# Altium schematic sheet Remote.SchDoc
size A2
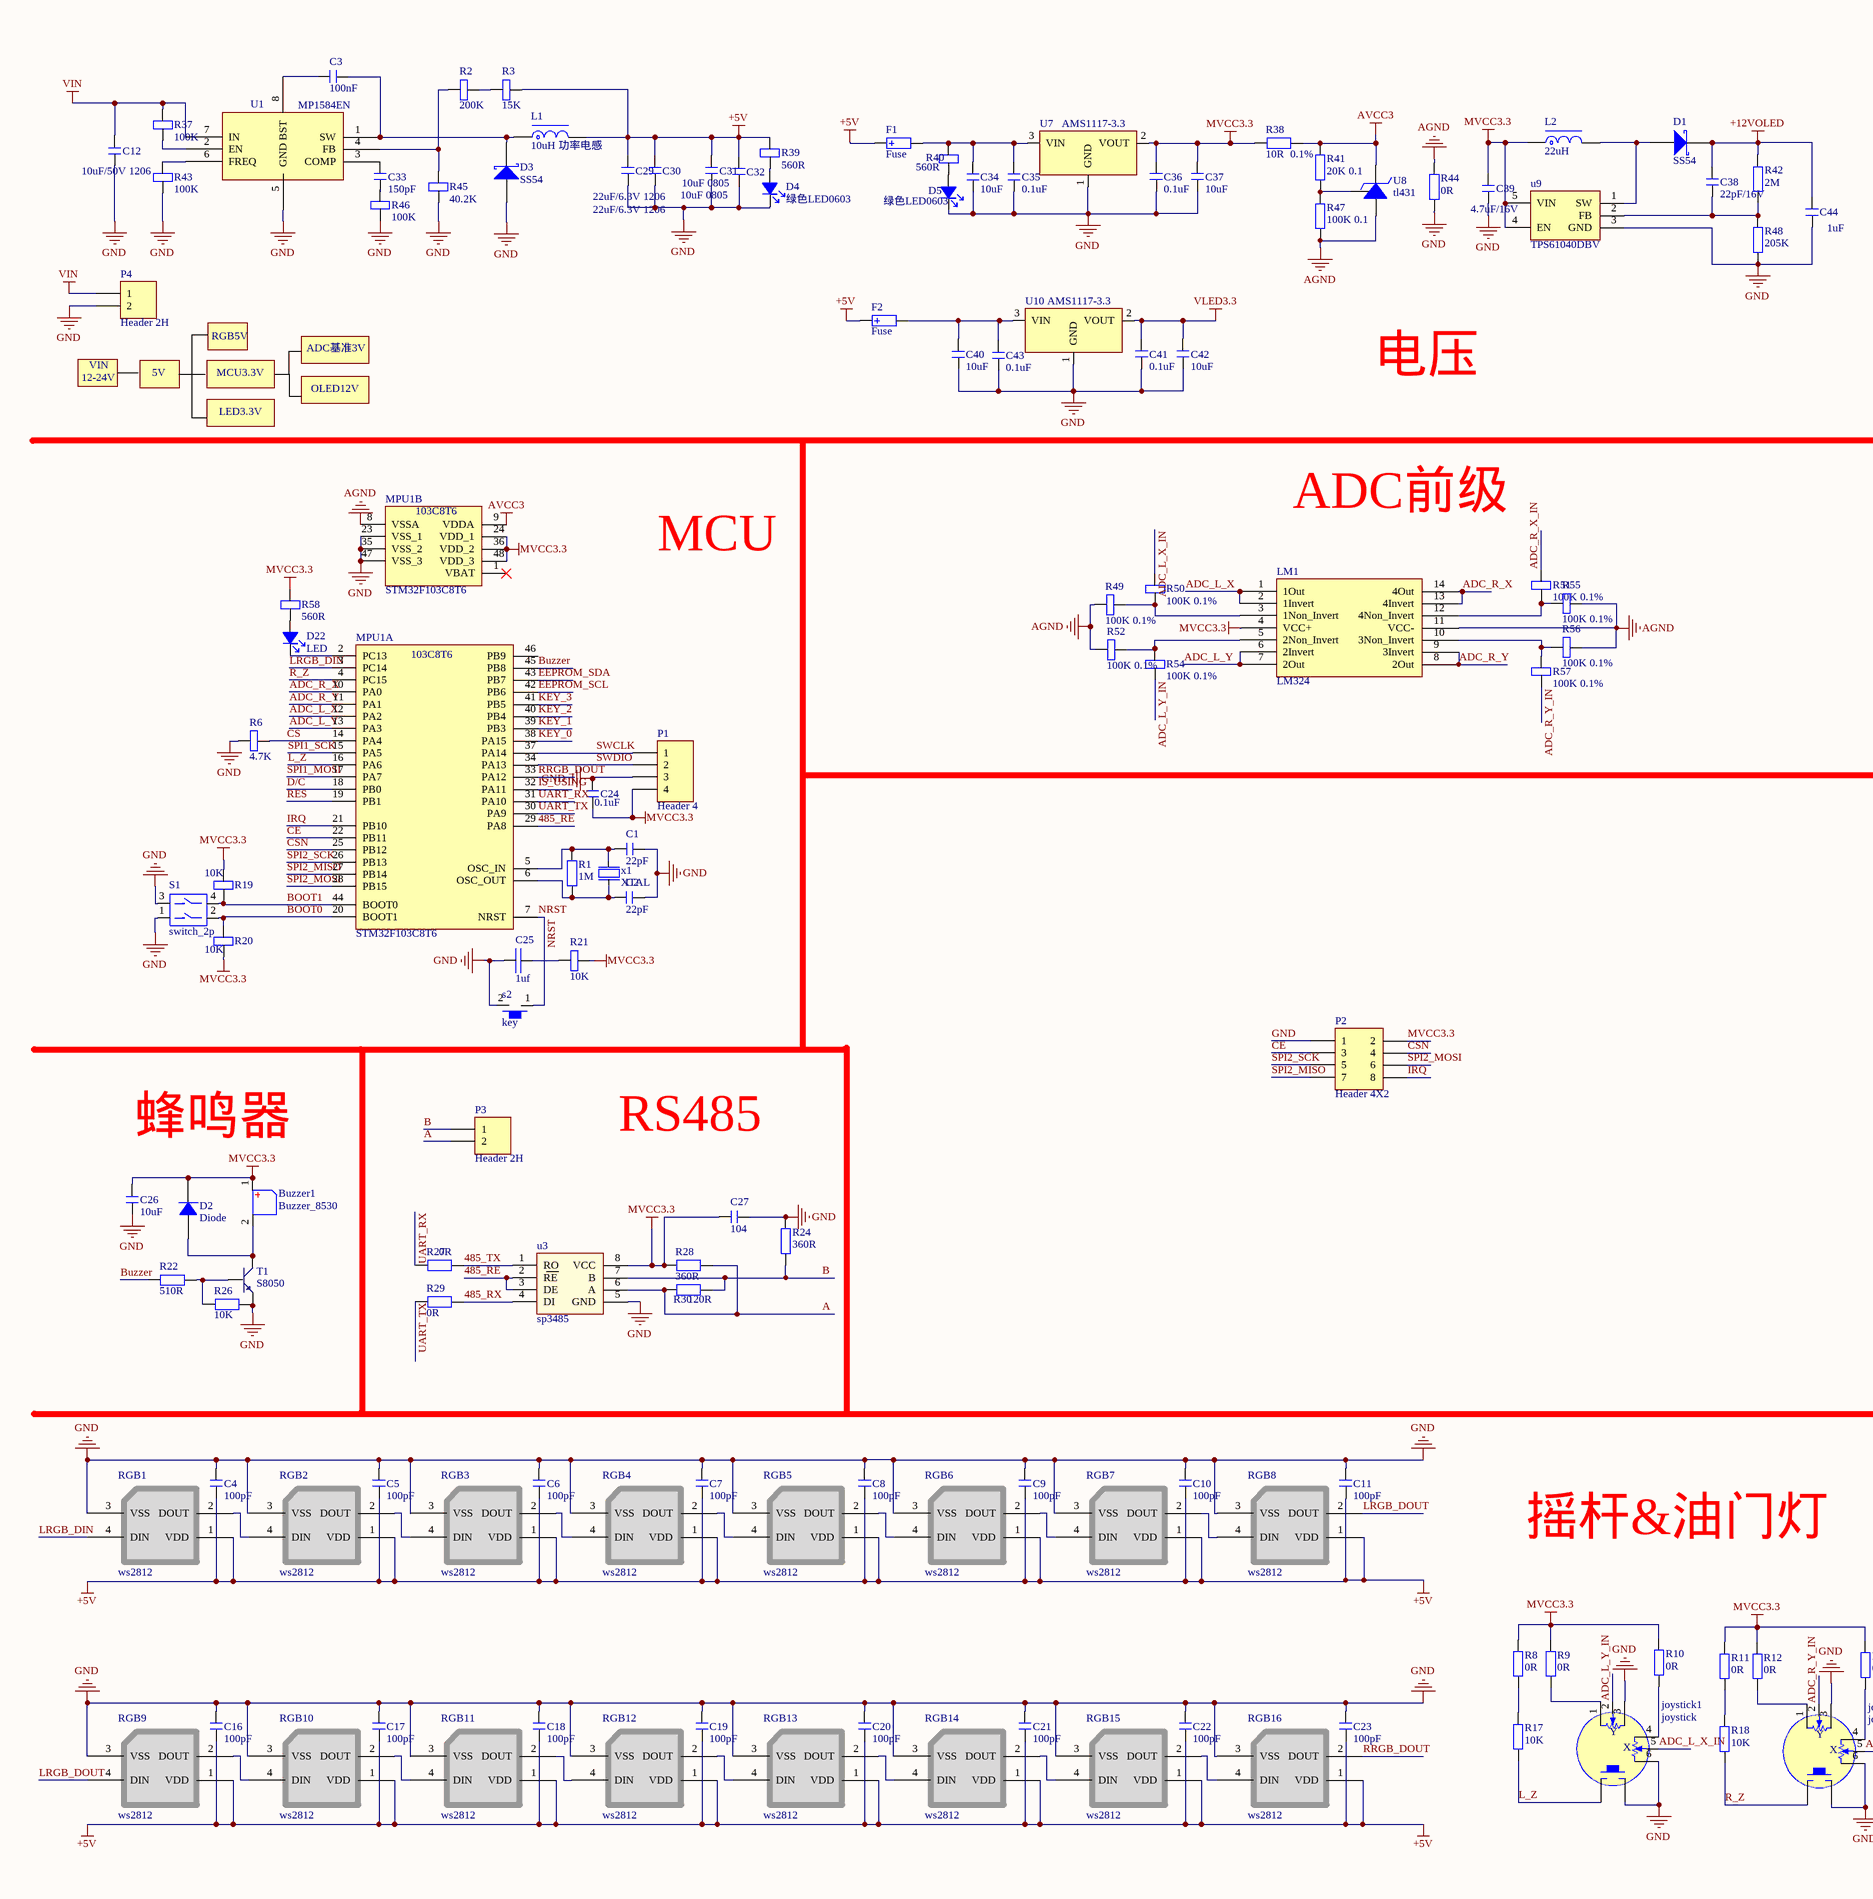
[diagram p0: Remote.SchDoc, left]
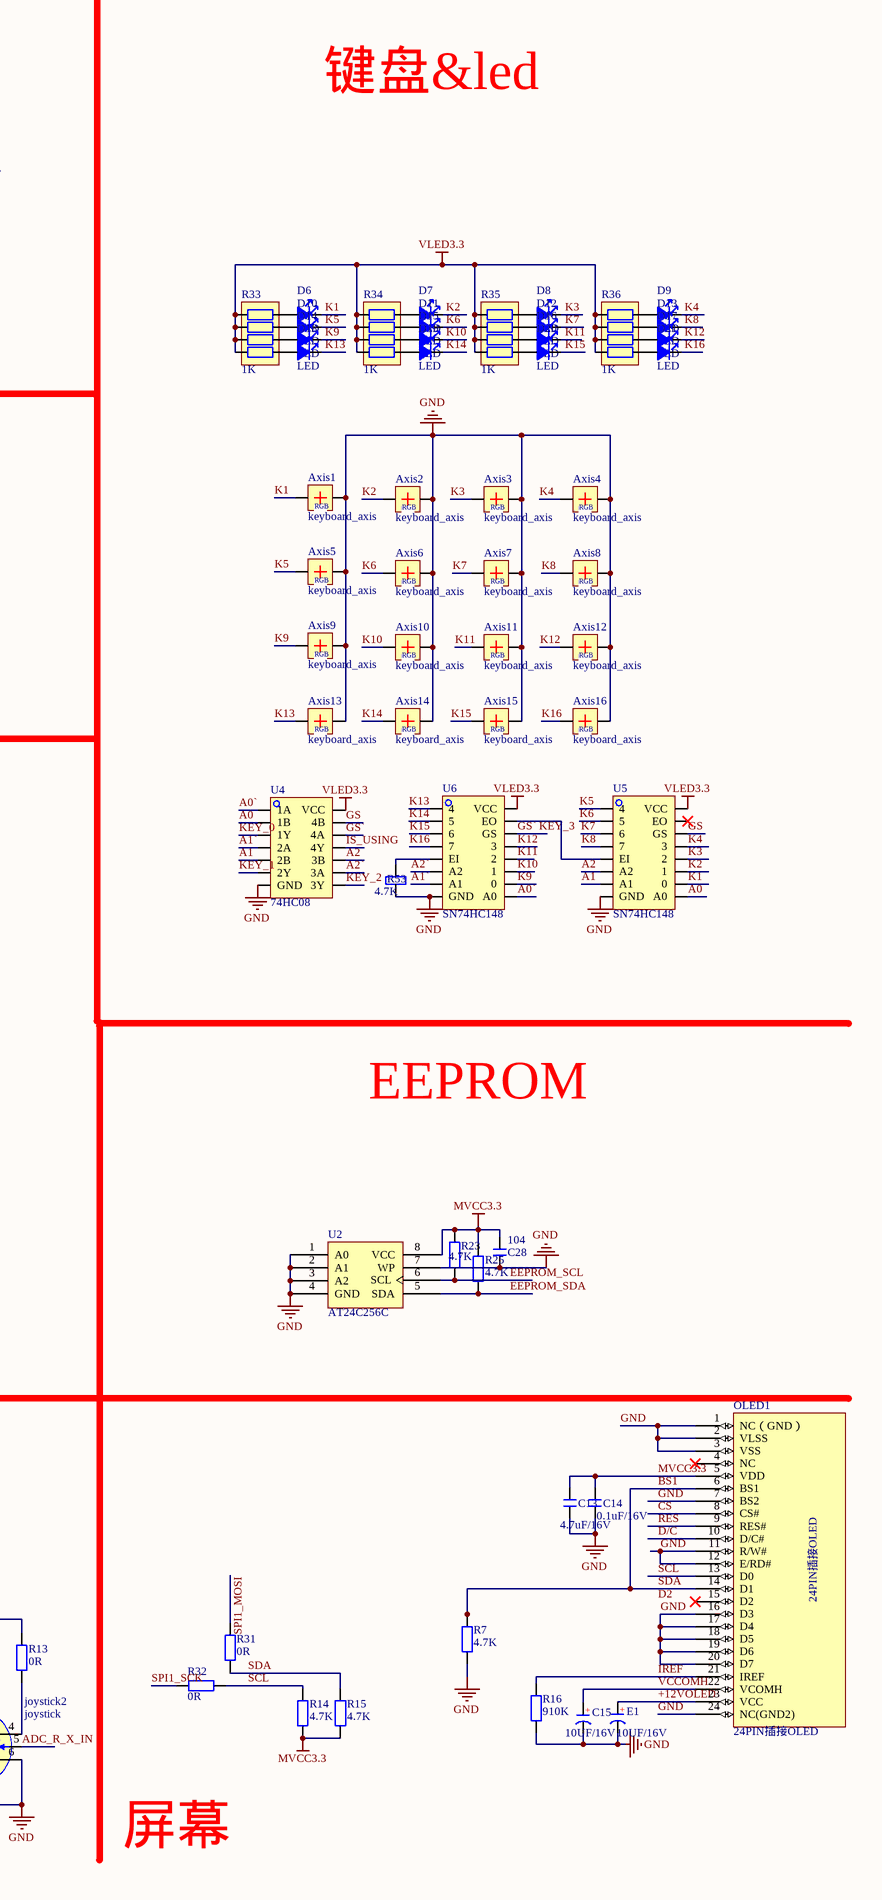
[diagram p1: Remote.SchDoc, right]

## Parts
Axis1  keyboard_axis  [KEY_AXIS]
Axis2  keyboard_axis  [KEY_AXIS]
Axis3  keyboard_axis  [KEY_AXIS]
Axis4  keyboard_axis  [KEY_AXIS]
Axis5  keyboard_axis  [KEY_AXIS]
Axis6  keyboard_axis  [KEY_AXIS]
Axis7  keyboard_axis  [KEY_AXIS]
Axis8  keyboard_axis  [KEY_AXIS]
Axis9  keyboard_axis  [KEY_AXIS]
Axis10  keyboard_axis  [KEY_AXIS]
Axis11  keyboard_axis  [KEY_AXIS]
Axis12  keyboard_axis  [KEY_AXIS]
Axis13  keyboard_axis  [KEY_AXIS]
Axis14  keyboard_axis  [KEY_AXIS]
Axis15  keyboard_axis  [KEY_AXIS]
Axis16  keyboard_axis  [KEY_AXIS]
Buzzer1  Buzzer_8530  [BUZZER_8530]
C1  22pF  [C 0603]
C2  22pF  [C 0603]
C3  100nF  [C 0603]
C4  100pF  [C 0603]
C5  100pF  [C 0603]
C6  100pF  [C 0603]
C7  100pF  [C 0603]
C8  100pF  [C 0603]
C9  100pF  [C 0603]
C10  100pF  [C 0603]
C11  100pF  [C 0603]
C12  10uF/50V 1206  [C 1206]
C13  4.7uF/16V  [C 0603]
C14  0.1uF/16V  [C 0402]
C15  10UF/16V  [C 1206 - polar]
C16  100pF  [C 0603]
C17  100pF  [C 0603]
C18  100pF  [C 0603]
C19  100pF  [C 0603]
C20  100pF  [C 0603]
C21  100pF  [C 0603]
C22  100pF  [C 0603]
C23  100pF  [C 0603]
C24  0.1uF  [C 0603]
C25  1uf  [0402]
C26  10uF  [C 0603]
C27  104  [C 0603]
C28  104  [C 0603]
C29  22uF/6.3V 1206  [C 1206]
C30  22uF/6.3V 1206  [C 1206]
C31  10uF 0805  [C 0805]
C32  10uF 0805  [C 0805]
C33  150pF  [C 0603]
C34  10uF  [C 0603]
C35  0.1uF  [C 0603]
C36  0.1uF  [C 0603]
C37  10uF  [C 0603]
C38  22pF/16V  [C 0603]
C39  4.7uF/16V  [C 0603]
C40  10uF  [C 0603]
C41  0.1uF  [C 0603]
C42  10uF  [C 0603]
C43  0.1uF  [C 0603]
C44  1uF  [C 0603]
D1  SS54  [DO-214AC/SMA]
D2  Diode  [SOD-123FL]
D3  SS54  [DO-214AC/SMA]
D4  绿色LED0603  [C 0603]
D5  绿色LED0603  [C 0603]
D6  LED  [C 0603]
D7  LED  [C 0603]
D8  LED  [C 0603]
D9  LED  [C 0603]
D10  LED  [C 0603]
D11  LED  [C 0603]
D12  LED  [C 0603]
D13  LED  [C 0603]
D14  LED  [C 0603]
D15  LED  [C 0603]
D16  LED  [C 0603]
D17  LED  [C 0603]
D18  LED  [C 0603]
D19  LED  [C 0603]
D20  LED  [C 0603]
D21  LED  [C 0603]
D22  LED  [C 0603]
E1  10UF/16V  [C 1206 - polar]
F1  Fuse  [F0805]
F2  Fuse  [F0805]
joystick1  joystick  [JoyStick]
joystick2  joystick  [JoyStick]
L1  10uH 功率电感  [10uH]
L2  22uH  [R 0805]
LM1  LM324  [LM324]
MPU1  STM32F103C8T6  [stm32f103c8t6]  (parts A,B of 2)
OLED1  24PIN插接OLED  [FPC0.5 2H-S-W-24P]
P1  Header 4  [HDR1X4]
P2  Header 4X2  [HDR2X4]
P3  Header 2H  [HDR1X2H]
P4  Header 2H  [XT30-PW-M]
R1  1M  [R 0603]
R2  200K  [R 0603]
R3  15K  [R 0603]
R6  4.7K  [R 0603]
R7  4.7K  [R 0603]
R8  0R  [R 0603]
R9  0R  [R 0603]
R10  0R  [R 0603]
R11  0R  [R 0603]
R12  0R  [R 0603]
R13  0R  [R 0603]
R14  4.7K  [R 0603]
R15  4.7K  [R 0603]
R16  910K  [R 0603]
R17  10K  [R 0603]
R18  10K  [R 0603]
R19  10K  [R 0603]
R20  10K  [R 0603]
R21  10K  [R 0603]
R22  510R  [R 0603]
R23  4.7K  [R 0603]
R24  360R  [R 0603]
R25  4.7K  [R 0603]
R26  10K  [R 0603]
R27  0R  [R 0402]
R28  360R  [R 0603]
R29  0R  [R 0402]
R30  120R  [R 0603]
R31  0R  [R 0603]
R32  0R  [R 0603]
R33  1K  [CHIP-ARRY]
R34  1K  [CHIP-ARRY]
R35  1K  [CHIP-ARRY]
R36  1K  [CHIP-ARRY]
R37  100K  [R 0603]
R38  10R  0.1%  [R 0603]
R39  560R  [R 0603]
R40  560R  [R 0603]
R41  20K 0.1  [R 0603]
R42  2M  [R 0603]
R43  100K  [R 0603]
R44  0R  [R 0603]
R45  40.2K  [R 0603]
R46  100K  [R 0603]
R47  100K 0.1  [R 0603]
R48  205K  [R 0603]
R49  100K 0.1%  [R 0603]
R50  100K 0.1%  [R 0603]
R51  100K 0.1%  [R 0603]
R52  100K 0.1%  [R 0603]
R53  4.7K  [R 0603]
R54  100K 0.1%  [R 0603]
R55  100K 0.1%  [R 0603]
R56  100K 0.1%  [R 0603]
R57  100K 0.1%  [R 0603]
R58  560R  [R 0603]
RGB1  ws2812  [WS2812-5050-4p]
RGB2  ws2812  [WS2812-5050-4p]
RGB3  ws2812  [WS2812-5050-4p]
RGB4  ws2812  [WS2812-5050-4p]
RGB5  ws2812  [WS2812-5050-4p]
RGB6  ws2812  [WS2812-5050-4p]
RGB7  ws2812  [WS2812-5050-4p]
RGB8  ws2812  [WS2812-5050-4p]
RGB9  ws2812  [WS2812-5050-4p]
RGB10  ws2812  [WS2812-5050-4p]
RGB11  ws2812  [WS2812-5050-4p]
RGB12  ws2812  [WS2812-5050-4p]
RGB13  ws2812  [WS2812-5050-4p]
RGB14  ws2812  [WS2812-5050-4p]
RGB15  ws2812  [WS2812-5050-4p]
RGB16  ws2812  [WS2812-5050-4p]
S1  switch_2p  [SWITCH_2P]
s2  key  [KEY]
T1  S8050  [SOT-23-3]
U1  MP1584EN  [SOIC-8-EP-150mil]
U2  AT24C256C  [SOIC-8]
u3  sp3485  [sp3485]
U4  74HC08  [SOIC-14-150MIL]
U5  SN74HC148  [SOIC-16-150mil]
U6  SN74HC148  [SOIC-16-150mil]
U7  AMS1117-3.3  [ASM1117]
U8  tl431  [SOT-23-3]
u9  TPS61040DBV  [SOT-23-5]
U10  AMS1117-3.3  [ASM1117]
x1  XTAL  [XTAL-5032-2p]

## Nets
+5V: C4.2 C5.2 C6.2 C7.2 C8.2 C9.2 C10.2 C11.2 C16.2 C17.2 C18.2 C19.2 C20.2 C21.2 C22.2 C23.2 C29.1 C30.1 C31.1 C32.1 F1.1 F2.1 L1.2 R3.2 R39.1 RGB1.1(VDD) RGB2.1(VDD) RGB3.1(VDD) RGB4.1(VDD) RGB5.1(VDD) RGB6.1(VDD) RGB7.1(VDD) RGB8.1(VDD) RGB9.1(VDD) RGB10.1(VDD) RGB11.1(VDD) RGB12.1(VDD) RGB13.1(VDD) RGB14.1(VDD) RGB15.1(VDD) RGB16.1(VDD)
+12VOLED: C38.2 C44.2 D1.2(K) E1.1(A) OLED1.23(VCC) R42.2
AGND: LM1.11(VCC-) MPU1.8(VSSA) R44.1 R47.1 R49.1 R52.1 R55.2 R56.2 U8.3
AVCC3: MPU1.9(VDDA) R38.1 R41.2 U8.2
GND: Axis1.2 Axis2.2 Axis3.2 Axis4.2 Axis5.2 Axis6.2 Axis7.2 Axis8.2 Axis9.2 Axis10.2 Axis11.2 Axis12.2 Axis13.2 Axis14.2 Axis15.2 Axis16.2 C1.2 C2.1 C4.1 C5.1 C6.1 C7.1 C8.1 C9.1 C10.1 C11.1 C12.1 C13.1 C14.1 C15.2(K) C16.1 C17.1 C18.1 C19.1 C20.1 C21.1 C22.1 C23.1 C24.2 C25.2 C26.1 C27.2 C28.2 C29.2 C30.2 C31.2 C32.2 C34.1 C35.1 C36.2 C37.2 C39.1 C40.1 C41.2 C42.2 C43.1 C44.1 D3.1(A) D4.2 D5.2 E1.2(K) joystick1.3 joystick1.6 joystick1.J1 joystick2.3 joystick2.6 joystick2.J1 MPU1.23(VSS_1) MPU1.35(VSS_2) MPU1.47(VSS_3) OLED1.1(NC（GND）) OLED1.2(VLSS) OLED1.3(VSS) OLED1.7(BS2) OLED1.11(R/W#) OLED1.12(E/RD#) OLED1.16(D3) OLED1.17(D4) OLED1.18(D5) OLED1.19(D6) OLED1.20(D7) OLED1.24(NC(GND2)) P1.3 P2.1 P4.2 R6.1 R7.1 R16.1 R24.2 R26.2 R43.1 R44.2 R45.1 R46.1 R48.1 R53.2 RGB1.3(VSS) RGB2.3(VSS) RGB3.3(VSS) RGB4.3(VSS) RGB5.3(VSS) RGB6.3(VSS) RGB7.3(VSS) RGB8.3(VSS) RGB9.3(VSS) RGB10.3(VSS) RGB11.3(VSS) RGB12.3(VSS) RGB13.3(VSS) RGB15.3(VSS) RGB16.3(VSS) S1.1 S1.3 s2.2 T1.2(E) U1.5(GND) U2.1(A0) U2.2(A1) U2.3(A2) U2.4(GND) U2.7(WP) u3.5(GND) U4.7(GND) U5.8(GND) U6.8(GND) U7.1(GND) u9.3(GND) U10.1(GND)
MVCC3.3: Buzzer1.1 C13.2 C14.2 C24.1 C26.2 C27.1 C28.1 C36.1 C37.1 C39.2 D2.2(K) L2.1 LM1.4(VCC+) MPU1.24(VDD_1) MPU1.36(VDD_2) MPU1.48(VDD_3) OLED1.5(VDD) P1.4 P2.2 R8.2 R9.1 R10.1 R11.2 R12.1 R13.1 R14.1 R15.1 R19.1 R20.2 R21.2 R23.2 R25.2 R28.1 R38.2 R58.2 U2.8(VCC) u3.8(VCC) U7.2(VOUT) u9.4(EN) u9.5(VIN)
VIN: C12.2 P4.1 R37.2 U1.7(IN)
VLED3.3: C41.1 C42.1 R33.1 R33.2 R33.3 R33.4 R34.1 R34.2 R34.3 R34.4 R35.1 R35.2 R35.3 R35.4 R36.1 R36.2 R36.3 R36.4 U4.14(VCC) U5.16(VCC) U6.16(VCC) U10.2(VOUT)
485_RE: MPU1.29(PA8) u3.2(RE) u3.3(DE)
485_RX: R29.2 u3.4(DI)
485_TX: R27.1 u3.1(RO)
A: P3.2 R28.2 R30.2 u3.6(A)
A0: U4.2(1B) U5.9(A0)
A0`: U4.1(1A) U6.9(A0)
A1: U4.5(2B) U5.7(A1)
A1`: U4.4(2A) U6.7(A1)
A2: U4.10(3B) U5.6(A2)
A2`: U4.9(3A) U6.6(A2)
ADC_L_X: LM1.1(1Out) LM1.2(1Invert) MPU1.12(PA2)
ADC_L_X_IN: joystick1.5 R50.2
ADC_L_Y: LM1.6(2Invert) LM1.7(2Out) MPU1.13(PA3)
ADC_L_Y_IN: joystick1.2 R54.2
ADC_R_X: LM1.13(4Invert) LM1.14(4Out) MPU1.10(PA0)
ADC_R_X_IN: joystick2.5 R51.2
ADC_R_Y: LM1.8(2Out) LM1.9(3Invert) MPU1.11(PA1)
ADC_R_Y_IN: joystick2.2 R57.2
B: P3.1 R24.1 R30.1 u3.7(B)
BOOT0: MPU1.20(BOOT1) R20.1 S1.2
BOOT1: MPU1.44(BOOT0) R19.2 S1.4
BS1: OLED1.6(BS1) OLED1.14(D1) R7.2 R15.2 R31.1  [also labelled SDA]
Buzzer: MPU1.45(PB8) R22.1
CE: MPU1.22(PB11) P2.3
CS: MPU1.14(PA4) OLED1.8(CS#) R6.2
CSN: MPU1.25(PB12) P2.4
D/C: MPU1.18(PB0) OLED1.10(D/C#)
EEPROM_SCL: MPU1.42(PB6) R23.1 U2.6(SCL)
EEPROM_SDA: MPU1.43(PB7) R25.1 U2.5(SDA)
GS: U4.13(4B) U5.14(GS)
GS`: MPU1.41(PB5) U4.12(4A) U6.14(GS)  [also labelled KEY_3]
IREF: OLED1.21(IREF) R16.2
IRQ: MPU1.21(PB10) P2.8
IS_USING: MPU1.32(PA11) U4.11(4Y)
K1: Axis1.1 D6.2 U5.10(0)
K2: Axis2.1 D7.2 U5.11(1)
K3: Axis3.1 D8.2 U5.12(2)
K4: Axis4.1 D9.2 U5.13(3)
K5: Axis5.1 D10.2 U5.1(4)
K6: Axis6.1 D11.2 U5.2(5)
K7: Axis7.1 D12.2 U5.3(6)
K8: Axis8.1 D13.2 U5.4(7)
K9: Axis9.1 D14.2 U6.10(0)
K10: Axis10.1 D15.2 U6.11(1)
K11: Axis11.1 D16.2 U6.12(2)
K12: Axis12.1 D17.2 U6.13(3)
K13: Axis13.1 D18.2 U6.1(4)
K14: Axis14.1 D19.2 U6.2(5)
K15: Axis15.1 D20.2 U6.3(6)
K16: Axis16.1 D21.2 U6.4(7)
KEY_0: MPU1.38(PA15) U4.3(1Y)
KEY_1: MPU1.39(PB3) U4.6(2Y)
KEY_2: MPU1.40(PB4) U4.8(3Y)
L_Z: joystick1.J2 MPU1.16(PA6) R17.1
LRGB_DIN: MPU1.3(PC14) RGB1.4(DIN)
LRGB_DOUT: RGB8.2(DOUT) RGB9.4(DIN)
NRST: MPU1.7(NRST) s2.1
R_Z: joystick2.J2 MPU1.4(PC15) R18.1
RES: MPU1.19(PB1) OLED1.9(RES#)
RRGB_DOUT: MPU1.33(PA12) RGB16.2(DOUT)
SCL: OLED1.13(D0) R14.2 R32.1
SPI1_MOSI: MPU1.17(PA7) R31.2
SPI1_SCK: MPU1.15(PA5) R32.2
SPI2_MISO: MPU1.27(PB14) P2.7
SPI2_MOSI: MPU1.28(PB15) P2.6
SPI2_SCK: MPU1.26(PB13) P2.5
SWCLK: MPU1.37(PA14) P1.1
SWDIO: MPU1.34(PA13) P1.2
UART_RX: MPU1.31(PA10) R27.2
UART_TX: MPU1.30(PA9) R29.1
VCCOMH: C15.1(A) OLED1.22(VCOMH)
NetBuzzer1_2: Buzzer1.2 D2.1(A) T1.3(C)
NetC1_1: C1.1 MPU1.5(OSC_IN) R1.2 x1.1
NetC2_2: C2.2 MPU1.6(OSC_OUT) R1.1 x1.2
NetC3_1: C3.1 D3.2(K) L1.1 U1.1(SW)
NetC3_2: C3.2 U1.8(BST)
NetC25_1: C25.1 R21.1
NetC33_1: C33.1 U1.3(COMP)
NetC33_2: C33.2 R46.2
NetC34_2: C34.2 C35.2 F1.2 R40.1 U7.3(VIN)
NetC38_1: C38.1 R42.1 R48.2 u9.2(FB)
NetC40_2: C40.2 C43.2 F2.2 U10.3(VIN)
NetD1_1: D1.1(A) L2.2 u9.1(SW)
NetD4_1: D4.1 R39.2
NetD5_1: D5.1 R40.2
NetD6_1: D6.1 R33.8
NetD7_1: D7.1 R34.8
NetD8_1: D8.1 R35.8
NetD9_1: D9.1 R36.8
NetD10_1: D10.1 R33.7
NetD11_1: D11.1 R34.7
NetD12_1: D12.1 R35.7
NetD13_1: D13.1 R36.7
NetD14_1: D14.1 R33.6
NetD15_1: D15.1 R34.6
NetD16_1: D16.1 R35.6
NetD17_1: D17.1 R36.6
NetD18_1: D18.1 R33.5
NetD19_1: D19.1 R34.5
NetD20_1: D20.1 R35.5
NetD21_1: D21.1 R36.5
NetD22_1: D22.1 R58.1
NetD22_2: D22.2 MPU1.2(PC13)
Netjoystick1_1: joystick1.1 R9.2
Netjoystick1_4: joystick1.4 R10.2
Netjoystick2_1: joystick2.1 R12.2
Netjoystick2_4: joystick2.4 R13.2
NetLM1_3: LM1.3(1Non_Invert) R49.2 R50.1
NetLM1_5: LM1.5(2Non_Invert) R52.2 R54.1
NetLM1_10: LM1.10(3Non_Invert) R56.1 R57.1
NetLM1_12: LM1.12(4Non_Invert) R51.1 R55.1
NetR2_1: R2.1 R3.1
NetR2_2: R2.2 R45.2 U1.4(FB)
NetR8_1: R8.1 R17.2
NetR11_1: R11.1 R18.2
NetR22_2: R22.2 R26.1 T1.1(B)
NetR37_1: R37.1 U1.2(EN)
NetR41_1: R41.1 R47.2 U8.1
NetR43_2: R43.2 U1.6(FREQ)
NetR53_1: R53.1 U6.5(EI)
NetRGB1_2: RGB1.2(DOUT) RGB2.4(DIN)
NetRGB2_2: RGB2.2(DOUT) RGB3.4(DIN)
NetRGB3_2: RGB3.2(DOUT) RGB4.4(DIN)
NetRGB4_2: RGB4.2(DOUT) RGB5.4(DIN)
NetRGB5_2: RGB5.2(DOUT) RGB6.4(DIN)
NetRGB6_2: RGB6.2(DOUT) RGB7.4(DIN)
NetRGB7_2: RGB7.2(DOUT) RGB8.4(DIN)
NetRGB9_2: RGB9.2(DOUT) RGB10.4(DIN)
NetRGB10_2: RGB10.2(DOUT) RGB11.4(DIN)
NetRGB11_2: RGB11.2(DOUT) RGB12.4(DIN)
NetRGB12_2: RGB12.2(DOUT) RGB13.4(DIN)
NetRGB13_2: RGB13.2(DOUT) RGB14.4(DIN)
NetRGB14_2: RGB14.2(DOUT) RGB15.4(DIN)
NetRGB15_2: RGB15.2(DOUT) RGB16.4(DIN)
NetU5_5: U5.5(EI) U6.15(EO)

Not connected (* = marked no-connect by the designer): MPU1 1(VBAT)* 46(PB9); OLED1 4(NC)* 15(D2)*; RGB14 3(VSS); U5 15(EO)*

## Notes on the sheet
- 键盘&led
- RGB5V
- 12-24V
- VIN
- 5V
- MCU3.3V
- ADC基准3V
- OLED12V
- 电压
- LED3.3V
- ADC前级
- MCU
- EEPROM
- 蜂鸣器
- RS485
- 摇杆&油门灯
- 屏幕
- Labels drawn without touching a wire or pin: D2
- (in symbol C-CAP) +
- (in symbol joystick) Y; X
- (in symbol keyboard_axis) RGB
- (in symbol STM32F103C8T6, part A) 103C8T6
- (in symbol STM32F103C8T6, part B) 103C8T6

## Library data of the parts
C1-C14 C16-C24 C26-C44 = C: 无极性贴片电容; 版权归属: 源创客; BOM名称: 无极性贴片电容; 学习资源: www.ooocke.com
C15 E1 = C-CAP: 直插电解电容; 版权归属: 源创客; BOM名称: 直插电解电容; 学习资源: www.ooocke.com
C25 = C
D1 D3 = Schottky Diode: 肖特基二极管; ComponentLink1Description: 供应商链接; ComponentLink1URL: http://www.szlcsc.com/product/details_9093.html; Package: SOD-123; Supplier: LC; SuppliersPartNumber: C8598
D2 = Diode: 二极管; 备注: 1N4007 4007 编号C2464 已经停售, 使用新物料编号C95872; ComponentLink1Description: 供应商链接; ComponentLink1URL: http://www.szlcsc.com/product/details_2841.html; Package: SMA(DO-214AC); Supplier: LC; SuppliersPartNumber: C95872
D4-D22 = LED: 发光二极管
F1 F2 = Fuse: 自恢复保险丝
L1 L2 = L: 小功率贴片电感; 版权归属: 源创客; BOM名称: 小功率贴片电感; 学习资源: www.ooocke.com
MPU1 = STM32F103C8T6: mcu
P1 = Header 4: Header, 4-Pin; LatestRevisionDate: 17-Jul-2002; LatestRevisionNote: Re-released for DXP Platform.; Publisher: Altium Limited
P2 = Header 4X2: Header, 4-Pin, Dual row; LatestRevisionDate: 17-Jul-2002; LatestRevisionNote: Re-released for DXP Platform.; Publisher: Altium Limited
P3 P4 = Header 2H: Header, 2-Pin, Right Angle; LatestRevisionDate: 17-Jul-2002; LatestRevisionNote: Re-released for DXP Platform.; Publisher: Altium Limited
R1 R7-R18 R22-R32 R38 R41 R42 R44 R47 R48 = R: 贴片电阻; 版权归属: 源创客; BOM名称: 贴片电阻; 学习资源: www.ooocke.com
R2 R3 R6 R19-R21 R37 R39 R40 R43 R45 R46 R49-R58 = R
R33-R36 = RA: 排阻
RGB1-RGB16 = ws2812: RGB集成光源
T1 = Triode: NPN
U1 = MP1584EN: 电源IC
U2 = AT24C256C: 256KBIT_EEPROM; BOM名称: 外置EEPROM; 版权归属: 源创客; 学习资源: www.ooocke.com
U5 U6 = SN74HC148: 8-3encoder
U8 = tl431: 精密电压基准ic
u9 = TPS61040DBV: DC-DC(BUCK)